# Altium schematic sheet LDO.SchDoc
size A4
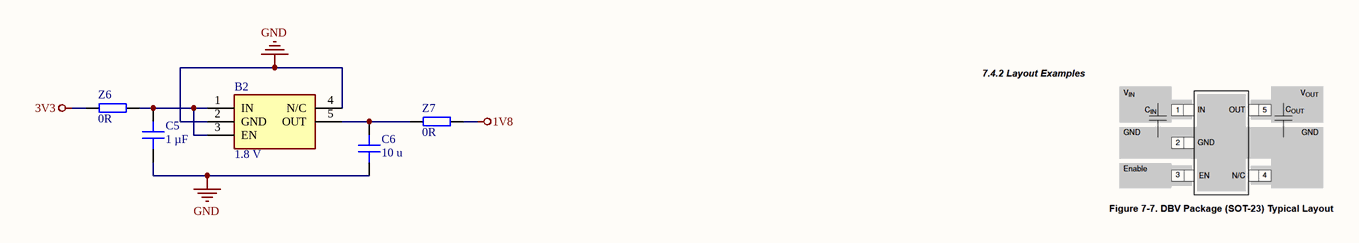
[diagram p0: LDO.SchDoc]

## Parts
B2  1.8 V  [SOT23-5_L]
C5  1 µF  [C_0603]
C6  10 u  [C_0603_TE]
Z6  0R  [RES 0603_1608]
Z7  0R  [RES 0603_1608]

## Nets
1V8: Z7.1
3V3: Z6.2
GND: B2.2(GND) B2.4(N/C) C5.1 C6.2
NetB2_1: B2.1(IN) B2.3(EN) C5.2 Z6.1
NetB2_5: B2.5(OUT) C6.1 Z7.2

## Notes on the sheet
- Title
- Revision:
- Design Engineer:
- Date:
- Project:
- Sheet
- of

## Library data of the parts
B2 = TPS7A2018PDBVR: 300mA, ultra-low noise, LDO, 1V6 < Vin < 6V, 0.8V < Vout < 5V5; Manufacturer_Name: Texas Instruments; Geometry.Height: 1.45mm; Created from: RWeimer; Mouser Part Number: 595-TPS7A2018PDBVR; Mouser Price/Stock: https://www.mouser.co.uk/ProductDetail/Texas-Instruments/TPS7A2018PDBVR?qs=hd1VzrDQEGheW9qdrIVGew%3D%3D; Manufacturer_Part_Number: TPS7A2018PDBVR; Datasheet Link: https://datasheet.datasheetarchive.com/originals/distributors/Datasheets_SAMA/e65d9d311cedf91014769949f3101225.pdf; Manufacturer Part Number: TPS7A2018PDBVR; PartID: 28; Created On: 29.05.2026 15:18:52; ComponentLink1Description: Datasheet; ComponentLink1URL: https://www.ti.com/lit/ds/symlink/tps7a20.pdf; Component Type: LDO; Device Package: SOT-23-5L; Last Updated: 29.05.2026 15:18:52; Manufacturer: Texas Instruments; Mounting Type: SMD; Operating Temperature: -40 to +125 °C; Series: TPS7A20; Supplier 1: Mouser; Supplier Part Number 1: 595-TPS7A2018PDBVR; Supplier 2: LCSC; Supplier Part Number 2: C963430; Type: LDO; Value: 1.8 V; Live Cycle Status: 1; LCSC Part Number: C963430; Stock number: not stored
C5 = C0603C105K3RAC7411: Capacitor 0603, 25 VDC, 1 µF, X7R; Manufacturer: KEMET; Tolerance: 10 %; Voltage Rating: 25 VDC; Created from: MGremer; Manufacturer Part Number: C0603C105K3RAC7411; PartID: 4; Created On: 20.12.2020 13:54:13; ComponentLink1Description: Datasheet; ComponentLink1URL: https://www.mouser.de/datasheet/2/212/KEM_C1002_X7R_SMD-1102033.pdf; Component Type: Capacitor 0603; Device Package: 0603; Last Updated: 03.06.2026 10:02:26; Mounting Type: SMD; Operating Temperature: -55 - 125°C; Series: SMD Comm X7R; Supplier 1: Mouser; Supplier Part Number 1: 80-C0603C105K3RLR; Supplier 2: LCSC; Supplier Part Number 2: C2177372; Type: Capacitor; Value: 1 µF; Live Cycle Status: 1; LCSC Part Number: C2177372; Stock number: Labor SMD Container
C6 = HGC0603R5106K350NTHJ: 10uF 35V X5R ±10% 0603 Multilayer Ceramic Capacitors MLCC; Manufacturer: Chinocera; Created from: RWeimer; Manufacturer Part Number: HGC0603R5106K350NTHJ; PartID: 513; Created On: 22.06.2026 13:41:26; ComponentLink1Description: Datasheet; ComponentLink1URL: https://www.lcsc.com/datasheet/C22367826.pdf; Component Type: Capacitor 0603; Device Package: 0603; Last Updated: 22.06.2026 13:41:26; Mounting Type: SMD; Operating Temperature: -55 to + 85°C; Series: X5R; Supplier 1: LCSC; Supplier Part Number 1: C22367826; Type: Capacitor; Tolerance: 10 %; Voltage Rating: 35 V; Value: 10 u; Live Cycle Status: 1; LCSC Part Number: C22367826
Z6 Z7 = RC0603JR-070RL: SMD resistor E24 series; Manufacturer: YAGEO; Tolerance: 5%; Created from: MGremer; Manufacturer Part Number: RC0603JR-070RL; PartID: 1; Created On: 14.12.2020 16:17:14; ComponentLink1Description: Datasheet; ComponentLink1URL: https://www.mouser.de/datasheet/2/447/PYu-RC_Group_51_RoHS_L_10-1664068.pdf; Component Type: SMD resistor; Device Package: 0603; Last Updated: 04.03.2021 09:09:42; Mounting Type: SMD; Supplier 1: Mouser; Supplier Part Number 1: 603-RC0603JR-070RL; Supplier 2: LCSC; Supplier Part Number 2: C21189; Type: Resistor; Value: 0R; Live Cycle Status: 1; Stock number: Labor SMD Container; LCSC Part Number: C21189